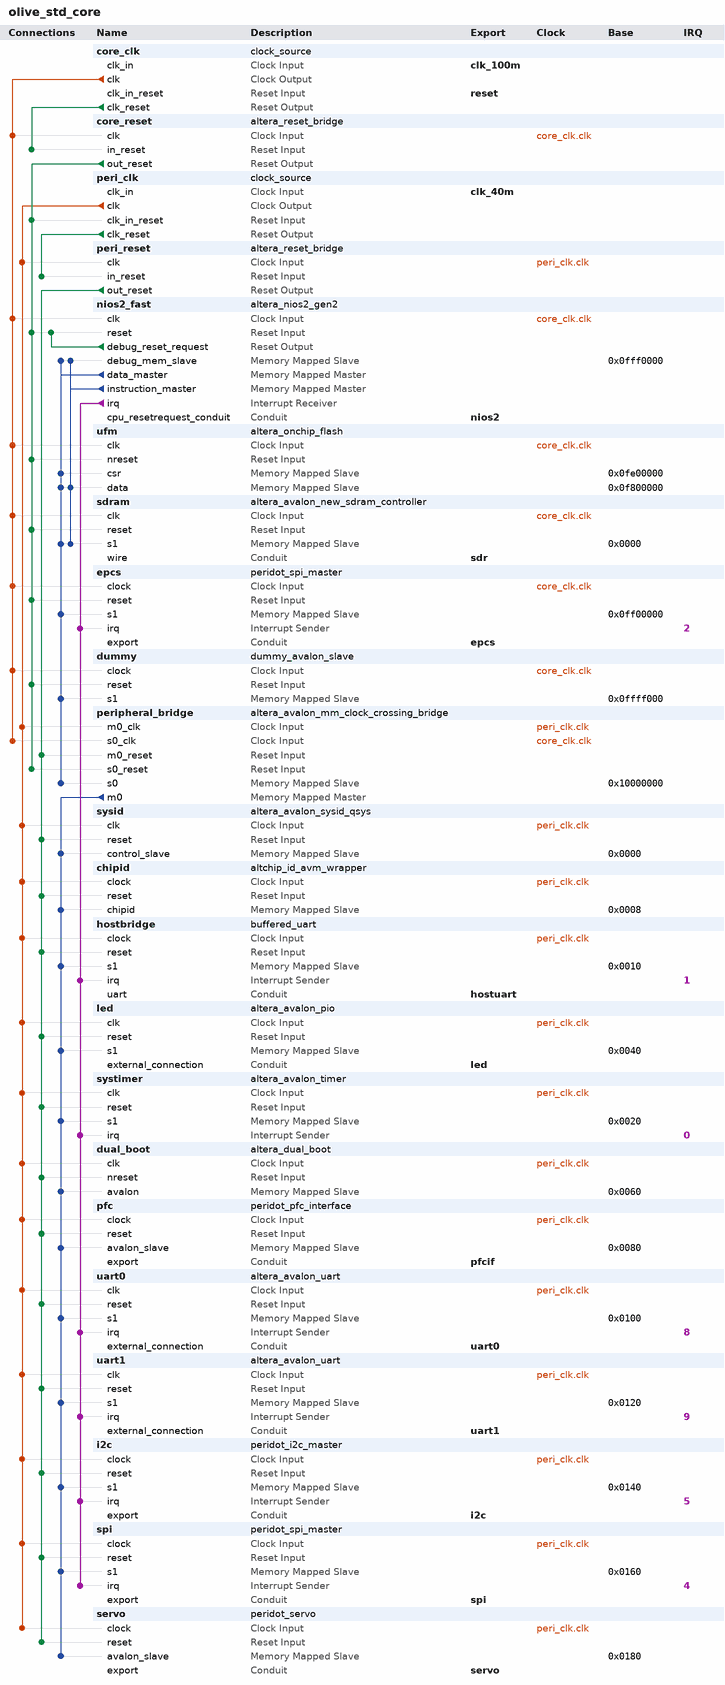
[diagram p0: system contents]
# Platform Designer (Qsys) system olive_std_core, MAX 10 10M08SAE144C8G
# Parameters at their usual value, and those the tool derives, are not listed.
package require -exact qsys 17.0
create_system olive_std_core
set_project_property DEVICE_FAMILY {MAX 10}
set_project_property DEVICE 10M08SAE144C8G

add_instance core_clk clock_source 17.0
set_instance_parameter_value core_clk clockFrequency 100000000

add_instance core_reset altera_reset_bridge 17.0
set_instance_parameter_value core_reset ACTIVE_LOW_RESET 0
set_instance_parameter_value core_reset SYNCHRONOUS_EDGES deassert

add_instance peri_clk clock_source 17.0
set_instance_parameter_value peri_clk clockFrequency 40000000

add_instance peri_reset altera_reset_bridge 17.0
set_instance_parameter_value peri_reset ACTIVE_LOW_RESET 0
set_instance_parameter_value peri_reset SYNCHRONOUS_EDGES deassert

add_instance nios2_fast altera_nios2_gen2 17.0
set_instance_parameter_value nios2_fast cpuReset true
set_instance_parameter_value nios2_fast dcache_size 8192
set_instance_parameter_value nios2_fast debug_hwbreakpoint 2
set_instance_parameter_value nios2_fast dividerType srt2
set_instance_parameter_value nios2_fast exceptionSlave sdram.s1
set_instance_parameter_value nios2_fast icache_size 16384
set_instance_parameter_value nios2_fast impl Fast
set_instance_parameter_value nios2_fast io_regionbase 268435456
set_instance_parameter_value nios2_fast mul_64_impl 1
set_instance_parameter_value nios2_fast resetSlave ufm.data
set_instance_parameter_value nios2_fast setting_branchpredictiontype Static
set_instance_parameter_value nios2_fast setting_shadowRegisterSets 7
set_instance_parameter_value nios2_fast shift_rot_impl 0

add_instance ufm altera_onchip_flash 17.0
set_instance_parameter_value ufm CONFIGURATION_MODE {Dual Compressed Images}
set_instance_parameter_value ufm READ_BURST_COUNT 2
set_instance_parameter_value ufm SECTOR_ACCESS_MODE {Read and write,Read and write,Read and write,Read and write,Hidden}
set_instance_parameter_value ufm initFlashContent true
set_instance_parameter_value ufm initializationFileName altera_onchip_flash.mif
set_instance_parameter_value ufm useNonDefaultInitFile true

add_instance sdram altera_avalon_new_sdram_controller 17.0
set_instance_parameter_value sdram TAC 6.0
set_instance_parameter_value sdram TRCD 21.0
set_instance_parameter_value sdram TRFC 63.0
set_instance_parameter_value sdram TRP 21.0
set_instance_parameter_value sdram casLatency 2
set_instance_parameter_value sdram columnWidth 8
set_instance_parameter_value sdram dataWidth 16
set_instance_parameter_value sdram generateSimulationModel false
set_instance_parameter_value sdram model single_Micron_MT48LC4M32B2_7_chip
set_instance_parameter_value sdram numberOfBanks 4
set_instance_parameter_value sdram numberOfChipSelects 1
set_instance_parameter_value sdram powerUpDelay 200.0
set_instance_parameter_value sdram refreshPeriod 15.625
set_instance_parameter_value sdram rowWidth 12

add_instance epcs peridot_spi_master 16.1
set_instance_parameter_value epcs CLOCKFREQ 100000000
set_instance_parameter_value epcs DEFAULT_REG_BITRVS 0
set_instance_parameter_value epcs DEFAULT_REG_CLKDIV 255
set_instance_parameter_value epcs DEFAULT_REG_MODE 0

add_instance dummy dummy_avalon_slave 16.1

add_instance peripheral_bridge altera_avalon_mm_clock_crossing_bridge 17.0
set_instance_parameter_value peripheral_bridge ADDRESS_WIDTH 10
set_instance_parameter_value peripheral_bridge COMMAND_FIFO_DEPTH 4
set_instance_parameter_value peripheral_bridge DATA_WIDTH 32
set_instance_parameter_value peripheral_bridge MASTER_SYNC_DEPTH 2
set_instance_parameter_value peripheral_bridge MAX_BURST_SIZE 1
set_instance_parameter_value peripheral_bridge RESPONSE_FIFO_DEPTH 4
set_instance_parameter_value peripheral_bridge SLAVE_SYNC_DEPTH 2
set_instance_parameter_value peripheral_bridge USE_AUTO_ADDRESS_WIDTH 1

add_instance sysid altera_avalon_sysid_qsys 17.0
set_instance_parameter_value sysid id 1923109377

add_instance chipid altchip_id_avm_wrapper 17.0
set_instance_parameter_value chipid CLOCKFREQ 40000000
set_instance_parameter_value chipid VALIDITY_ASSERTION WAIT

add_instance hostbridge buffered_uart 16.1
set_instance_parameter_value hostbridge CLOCK_FREQ 40000000
set_instance_parameter_value hostbridge CUSTOM_BAUD 115200
set_instance_parameter_value hostbridge DATA_BITS 8
set_instance_parameter_value hostbridge FIXED_BAUD true
set_instance_parameter_value hostbridge LIST_BAUD 921600
set_instance_parameter_value hostbridge MANUAL_DIV_BITS 8
set_instance_parameter_value hostbridge RX_DEPTH_BITS 10
set_instance_parameter_value hostbridge TX_DEPTH_BITS 10
set_instance_parameter_value hostbridge USE_RTSCTS false

add_instance led altera_avalon_pio 17.0
set_instance_parameter_value led direction Output
set_instance_parameter_value led width 1

add_instance systimer altera_avalon_timer 17.0
set_instance_parameter_value systimer period 1
set_instance_parameter_value systimer periodUnits MSEC

add_instance dual_boot altera_dual_boot 17.0
set_instance_parameter_value dual_boot CLOCK_FREQUENCY 40.0

add_instance pfc peridot_pfc_interface 16.1

add_instance uart0 altera_avalon_uart 17.0
set_instance_parameter_value uart0 baud 115200
set_instance_parameter_value uart0 dataBits 8
set_instance_parameter_value uart0 fixedBaud false
set_instance_parameter_value uart0 parity NONE
set_instance_parameter_value uart0 stopBits 1
set_instance_parameter_value uart0 useCtsRts true

add_instance uart1 altera_avalon_uart 17.0
set_instance_parameter_value uart1 baud 115200
set_instance_parameter_value uart1 dataBits 8
set_instance_parameter_value uart1 fixedBaud false
set_instance_parameter_value uart1 parity NONE
set_instance_parameter_value uart1 stopBits 1
set_instance_parameter_value uart1 useCtsRts true

add_instance i2c peridot_i2c_master 16.1
set_instance_parameter_value i2c CLOCKFREQ 40000000

add_instance spi peridot_spi_master 16.1
set_instance_parameter_value spi CLOCKFREQ 40000000
set_instance_parameter_value spi DEFAULT_REG_BITRVS 0
set_instance_parameter_value spi DEFAULT_REG_CLKDIV 255
set_instance_parameter_value spi DEFAULT_REG_MODE 0

add_instance servo peridot_servo 16.1
set_instance_parameter_value servo CLOCKFREQ 40000000
set_instance_parameter_value servo PWM_CHANNEL 8

# connections
add_connection core_clk.clk core_reset.clk clock
add_connection core_clk.clk dummy.clock clock
add_connection core_clk.clk epcs.clock clock
add_connection core_clk.clk nios2_fast.clk clock
add_connection core_clk.clk peripheral_bridge.s0_clk clock
add_connection core_clk.clk sdram.clk clock
add_connection core_clk.clk ufm.clk clock
add_connection peri_clk.clk chipid.clock clock
add_connection peri_clk.clk dual_boot.clk clock
add_connection peri_clk.clk hostbridge.clock clock
add_connection peri_clk.clk i2c.clock clock
add_connection peri_clk.clk led.clk clock
add_connection peri_clk.clk peri_reset.clk clock
add_connection peri_clk.clk peripheral_bridge.m0_clk clock
add_connection peri_clk.clk pfc.clock clock
add_connection peri_clk.clk servo.clock clock
add_connection peri_clk.clk spi.clock clock
add_connection peri_clk.clk sysid.clk clock
add_connection peri_clk.clk systimer.clk clock
add_connection peri_clk.clk uart0.clk clock
add_connection peri_clk.clk uart1.clk clock
add_connection core_clk.clk_reset core_reset.in_reset reset
add_connection core_reset.out_reset dummy.reset reset
add_connection core_reset.out_reset epcs.reset reset
add_connection core_reset.out_reset nios2_fast.reset reset
add_connection core_reset.out_reset peri_clk.clk_in_reset reset
add_connection core_reset.out_reset peripheral_bridge.s0_reset reset
add_connection core_reset.out_reset sdram.reset reset
add_connection core_reset.out_reset ufm.nreset reset
add_connection nios2_fast.debug_reset_request nios2_fast.reset reset
add_connection peri_clk.clk_reset peri_reset.in_reset reset
add_connection peri_reset.out_reset chipid.reset reset
add_connection peri_reset.out_reset dual_boot.nreset reset
add_connection peri_reset.out_reset hostbridge.reset reset
add_connection peri_reset.out_reset i2c.reset reset
add_connection peri_reset.out_reset led.reset reset
add_connection peri_reset.out_reset peripheral_bridge.m0_reset reset
add_connection peri_reset.out_reset pfc.reset reset
add_connection peri_reset.out_reset servo.reset reset
add_connection peri_reset.out_reset spi.reset reset
add_connection peri_reset.out_reset sysid.reset reset
add_connection peri_reset.out_reset systimer.reset reset
add_connection peri_reset.out_reset uart0.reset reset
add_connection peri_reset.out_reset uart1.reset reset
add_connection nios2_fast.data_master dummy.s1 avalon
set_connection_parameter_value nios2_fast.data_master/dummy.s1 baseAddress 0x0ffff000
set_connection_parameter_value nios2_fast.data_master/dummy.s1 defaultConnection true
add_connection nios2_fast.data_master epcs.s1 avalon
set_connection_parameter_value nios2_fast.data_master/epcs.s1 baseAddress 0x0ff00000
add_connection nios2_fast.data_master nios2_fast.debug_mem_slave avalon
set_connection_parameter_value nios2_fast.data_master/nios2_fast.debug_mem_slave baseAddress 0x0fff0000
add_connection nios2_fast.data_master peripheral_bridge.s0 avalon
set_connection_parameter_value nios2_fast.data_master/peripheral_bridge.s0 baseAddress 0x10000000
add_connection nios2_fast.data_master sdram.s1 avalon
set_connection_parameter_value nios2_fast.data_master/sdram.s1 baseAddress 0x0000
add_connection nios2_fast.data_master ufm.csr avalon
set_connection_parameter_value nios2_fast.data_master/ufm.csr baseAddress 0x0fe00000
add_connection nios2_fast.data_master ufm.data avalon
set_connection_parameter_value nios2_fast.data_master/ufm.data baseAddress 0x0f800000
add_connection nios2_fast.instruction_master nios2_fast.debug_mem_slave avalon
set_connection_parameter_value nios2_fast.instruction_master/nios2_fast.debug_mem_slave baseAddress 0x0fff0000
add_connection nios2_fast.instruction_master sdram.s1 avalon
set_connection_parameter_value nios2_fast.instruction_master/sdram.s1 baseAddress 0x0000
add_connection nios2_fast.instruction_master ufm.data avalon
set_connection_parameter_value nios2_fast.instruction_master/ufm.data baseAddress 0x0f800000
add_connection peripheral_bridge.m0 chipid.chipid avalon
set_connection_parameter_value peripheral_bridge.m0/chipid.chipid baseAddress 0x0008
add_connection peripheral_bridge.m0 dual_boot.avalon avalon
set_connection_parameter_value peripheral_bridge.m0/dual_boot.avalon baseAddress 0x0060
add_connection peripheral_bridge.m0 hostbridge.s1 avalon
set_connection_parameter_value peripheral_bridge.m0/hostbridge.s1 baseAddress 0x0010
add_connection peripheral_bridge.m0 i2c.s1 avalon
set_connection_parameter_value peripheral_bridge.m0/i2c.s1 baseAddress 0x0140
add_connection peripheral_bridge.m0 led.s1 avalon
set_connection_parameter_value peripheral_bridge.m0/led.s1 baseAddress 0x0040
add_connection peripheral_bridge.m0 pfc.avalon_slave avalon
set_connection_parameter_value peripheral_bridge.m0/pfc.avalon_slave baseAddress 0x0080
add_connection peripheral_bridge.m0 servo.avalon_slave avalon
set_connection_parameter_value peripheral_bridge.m0/servo.avalon_slave baseAddress 0x0180
add_connection peripheral_bridge.m0 spi.s1 avalon
set_connection_parameter_value peripheral_bridge.m0/spi.s1 baseAddress 0x0160
add_connection peripheral_bridge.m0 sysid.control_slave avalon
set_connection_parameter_value peripheral_bridge.m0/sysid.control_slave baseAddress 0x0000
add_connection peripheral_bridge.m0 systimer.s1 avalon
set_connection_parameter_value peripheral_bridge.m0/systimer.s1 baseAddress 0x0020
add_connection peripheral_bridge.m0 uart0.s1 avalon
set_connection_parameter_value peripheral_bridge.m0/uart0.s1 baseAddress 0x0100
add_connection peripheral_bridge.m0 uart1.s1 avalon
set_connection_parameter_value peripheral_bridge.m0/uart1.s1 baseAddress 0x0120
add_connection nios2_fast.irq epcs.irq interrupt
set_connection_parameter_value nios2_fast.irq/epcs.irq irqNumber 2
add_connection nios2_fast.irq hostbridge.irq interrupt
set_connection_parameter_value nios2_fast.irq/hostbridge.irq irqNumber 1
add_connection nios2_fast.irq i2c.irq interrupt
set_connection_parameter_value nios2_fast.irq/i2c.irq irqNumber 5
add_connection nios2_fast.irq spi.irq interrupt
set_connection_parameter_value nios2_fast.irq/spi.irq irqNumber 4
add_connection nios2_fast.irq systimer.irq interrupt
set_connection_parameter_value nios2_fast.irq/systimer.irq irqNumber 0
add_connection nios2_fast.irq uart0.irq interrupt
set_connection_parameter_value nios2_fast.irq/uart0.irq irqNumber 8
add_connection nios2_fast.irq uart1.irq interrupt
set_connection_parameter_value nios2_fast.irq/uart1.irq irqNumber 9

# exported interfaces
add_interface clk_100m clock sink
set_interface_property clk_100m EXPORT_OF core_clk.clk_in
add_interface clk_40m clock sink
set_interface_property clk_40m EXPORT_OF peri_clk.clk_in
add_interface epcs conduit end
set_interface_property epcs EXPORT_OF epcs.export
add_interface hostuart conduit end
set_interface_property hostuart EXPORT_OF hostbridge.uart
add_interface i2c conduit end
set_interface_property i2c EXPORT_OF i2c.export
add_interface led conduit end
set_interface_property led EXPORT_OF led.external_connection
add_interface nios2 conduit end
set_interface_property nios2 EXPORT_OF nios2_fast.cpu_resetrequest_conduit
add_interface pfcif conduit end
set_interface_property pfcif EXPORT_OF pfc.export
add_interface reset reset sink
set_interface_property reset EXPORT_OF core_clk.clk_in_reset
add_interface sdr conduit end
set_interface_property sdr EXPORT_OF sdram.wire
add_interface servo conduit end
set_interface_property servo EXPORT_OF servo.export
add_interface spi conduit end
set_interface_property spi EXPORT_OF spi.export
add_interface uart0 conduit end
set_interface_property uart0 EXPORT_OF uart0.external_connection
add_interface uart1 conduit end
set_interface_property uart1 EXPORT_OF uart1.external_connection

set_interconnect_requirement {$system} qsys_mm.clockCrossingAdapter HANDSHAKE
set_interconnect_requirement {$system} qsys_mm.enableEccProtection FALSE
set_interconnect_requirement {$system} qsys_mm.insertDefaultSlave FALSE
set_interconnect_requirement {$system} qsys_mm.maxAdditionalLatency 1
set_interconnect_requirement {mm_interconnect_0|ufm_data_agent.rp/router_002.sink} qsys_mm.postTransform.pipelineCount 1

save_system olive_std_core.qsys
